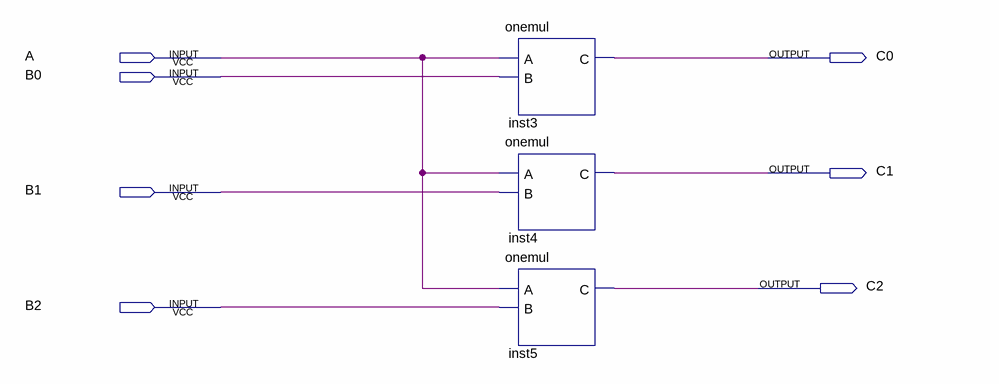
[diagram p0: schematic sheet]
// Quartus schematic thrmul.bdf as structural Verilog: 3 symbols, 7 pins
module thrmul (
  input  A,
  input  B0,
  input  B1,
  input  B2,
  output C0,
  output C1,
  output C2
);

  onemul inst3 (.A(A), .B(B0), .C(C0));
  onemul inst4 (.A(A), .B(B1), .C(C1));
  onemul inst5 (.A(A), .B(B2), .C(C2));
endmodule
